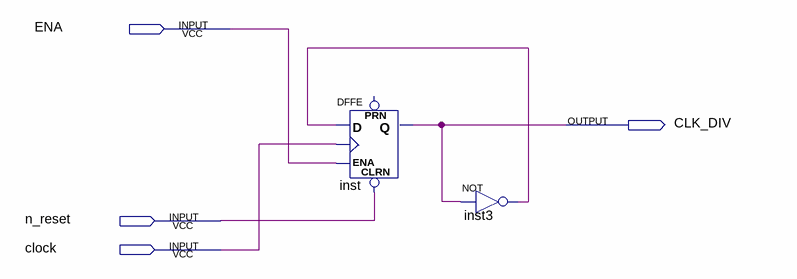
[diagram p0: schematic sheet]
// Quartus schematic clk_divider_altera_2.bdf as structural Verilog: 2 symbols, 4 pins
module clk_divider_altera_2 (
  input  ENA,
  input  n_reset,
  input  clock,
  output CLK_DIV
);

  wire inst3_out;

  DFFE inst (.CLRN(n_reset), .D(inst3_out), .CLK(clock), .ENA(ENA), .Q(CLK_DIV));  // open: PRN
  not inst3 (inst3_out, CLK_DIV);
endmodule
